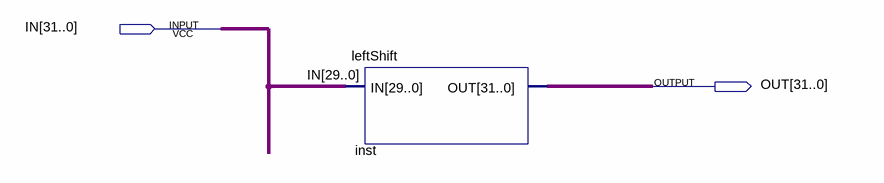
[diagram p0: schematic sheet]
// Quartus schematic leftShiftcontainer.bdf as structural Verilog: 1 symbols, 2 pins
module leftShiftcontainer (
  input  [31:0] IN,
  output [31:0] OUT
);

  leftShift inst (.IN(IN[29:0]), .OUT(OUT));
endmodule
